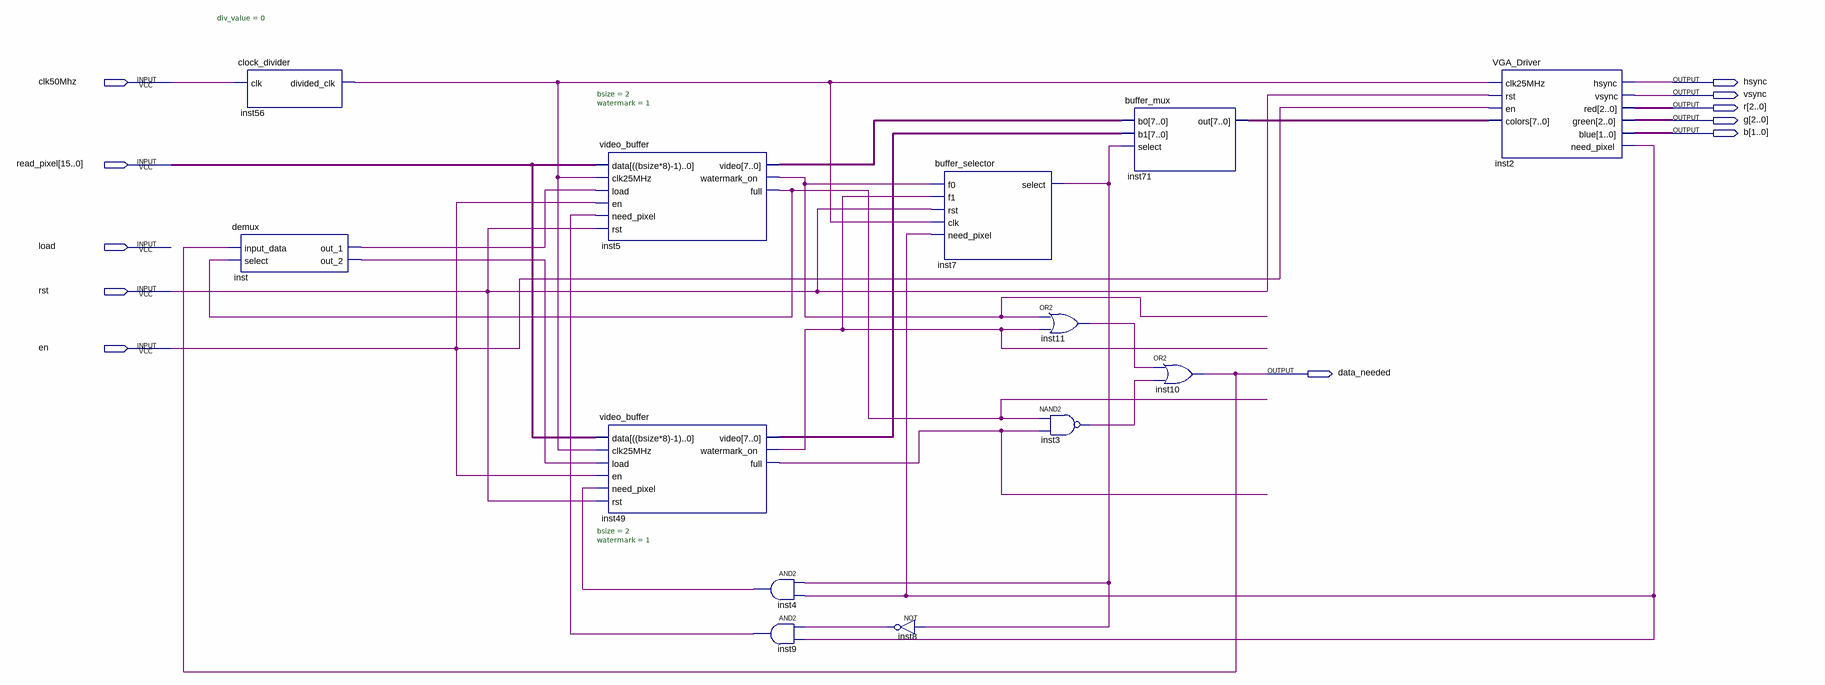
[diagram p0: schematic sheet]
// Quartus schematic VGA.bdf as structural Verilog: 13 symbols, 11 pins
module VGA (
  input  clk50Mhz,
  input  [15:0] read_pixel,
  input  load,
  input  rst,
  input  en,
  output hsync,
  output vsync,
  output [2:0] r,
  output [2:0] g,
  output [1:0] b,
  output data_needed
);

  wire inst2_need_pixel, inst3_out, inst4_out, inst5_full, inst5_watermark_on, inst7_select, inst8_out,
       inst9_out, inst11_out, inst49_full, inst49_watermark_on, inst56_divided_clk, inst_out_1, inst_out_2;
  wire [7:0] inst5_video, inst49_video, inst71_out;

  clock_divider #(.div_value(0)) inst56 (.clk(clk50Mhz), .divided_clk(inst56_divided_clk));
  demux inst (.input_data(data_needed), .select(inst5_full), .out_1(inst_out_1), .out_2(inst_out_2));
  video_buffer #(.bsize(2), .watermark(1)) inst5 (
    .data(read_pixel), .clk25MHz(inst56_divided_clk), .load(inst_out_1), .en(en), .need_pixel(inst9_out),
    .rst(rst), .video(inst5_video), .watermark_on(inst5_watermark_on), .full(inst5_full));
  video_buffer #(.bsize(2), .watermark(1)) inst49 (
    .data(read_pixel), .clk25MHz(inst56_divided_clk), .load(inst_out_2), .en(en), .need_pixel(inst4_out),
    .rst(rst), .video(inst49_video), .watermark_on(inst49_watermark_on), .full(inst49_full));
  and inst4 (inst4_out, inst7_select, inst2_need_pixel);
  and inst9 (inst9_out, inst8_out, inst2_need_pixel);
  not inst8 (inst8_out, inst7_select);
  buffer_selector inst7 (
    .f0(inst5_watermark_on), .f1(inst49_watermark_on), .rst(rst), .clk(inst56_divided_clk),
    .need_pixel(inst2_need_pixel), .select(inst7_select));
  or inst11 (inst11_out, inst5_watermark_on, inst49_watermark_on);
  nand inst3 (inst3_out, inst5_full, inst49_full);
  buffer_mux inst71 (.b0(inst5_video), .b1(inst49_video), .select(inst7_select), .out(inst71_out));
  or inst10 (data_needed, inst11_out, inst3_out);
  VGA_Driver inst2 (
    .clk25MHz(inst56_divided_clk), .rst(rst), .en(en), .colors(inst71_out), .hsync(hsync), .vsync(vsync),
    .red(r), .green(g), .blue(b), .need_pixel(inst2_need_pixel));
endmodule
